# Altium schematic sheet power.SchDoc
size A4; SheetNumber: 4; SheetTotal: 5
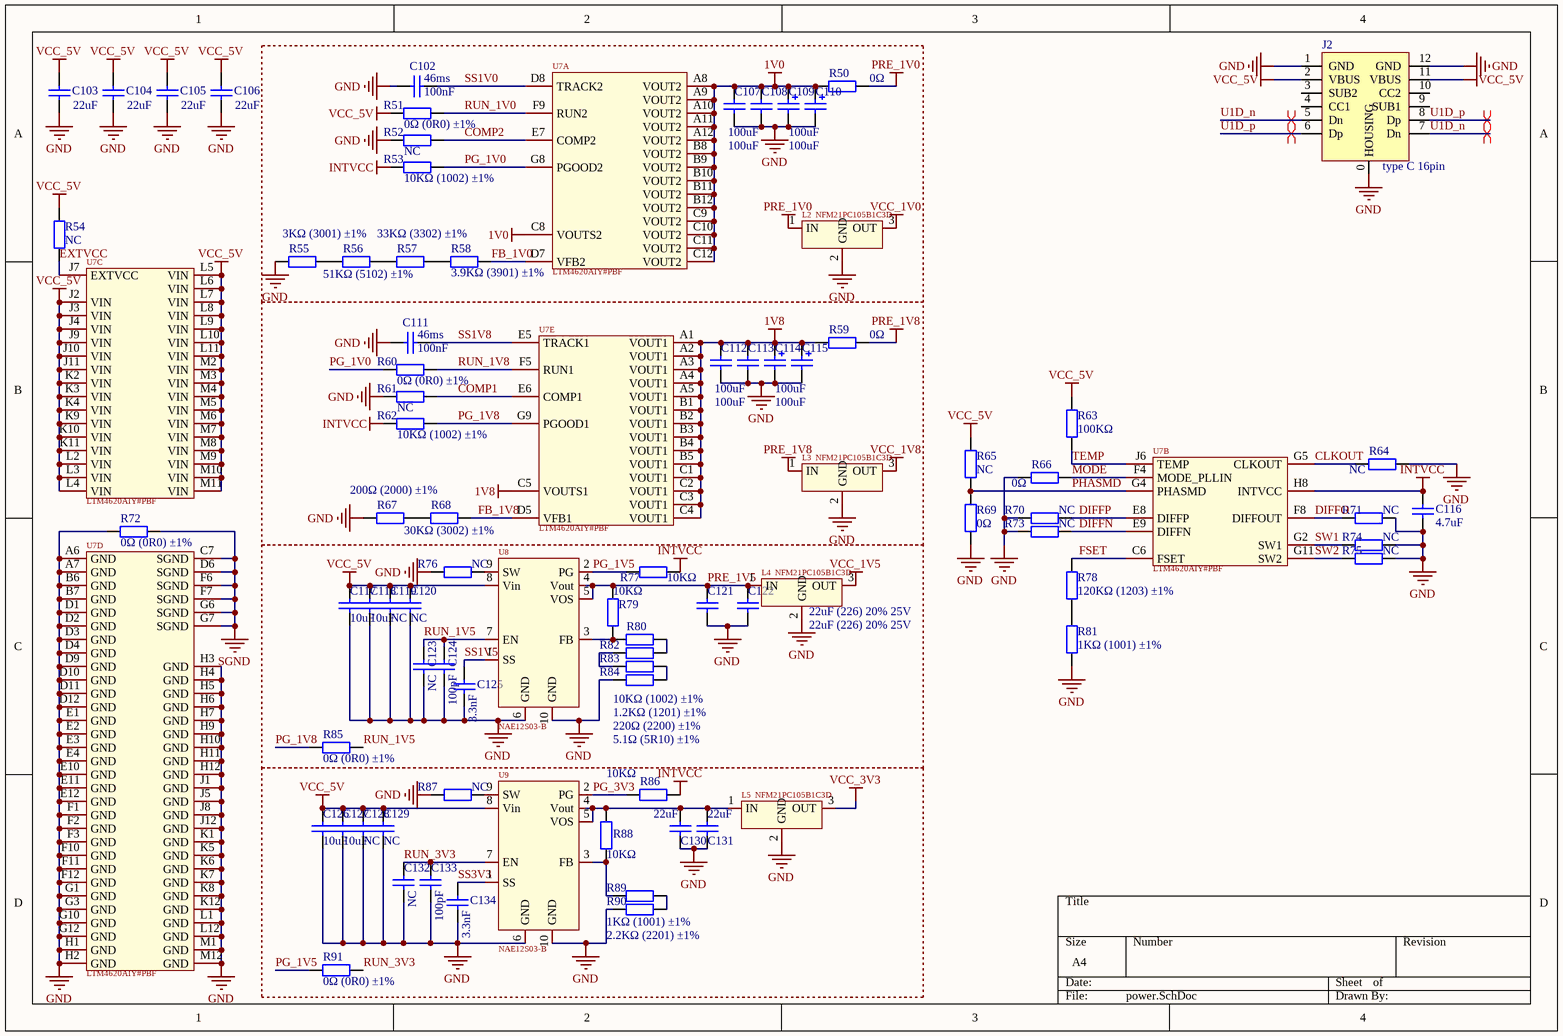
[diagram p0: power.SchDoc]

## Parts
C102  100nF  [0805_C]
C103  22uF  [0805_C]
C104  22uF  [0805_C]
C105  22uF  [0805_C]
C106  22uF  [0805_C]
C107  100uF  [1206_C]
C108  100uF  [1206_C]
C109  100uF  [CASE-B_3528]
C110  100uF  [CASE-B_3528]
C111  100nF  [0805_C]
C112  100uF  [1206_C]
C113  100uF  [1206_C]
C114  100uF  [CASE-B_3528]
C115  100uF  [CASE-B_3528]
C116  4.7uF  [0805_C]
C117  10uF  [0805_C]
C118  10uF  [0805_C]
C119  NC  [0805_C]
C120  NC  [0805_C]
C121  22uF (226) 20% 25V  [0805_C]
C122  22uF (226) 20% 25V  [0805_C]
C123  NC  [0805_C]
C124  100pF  [0805_C]
C125  3.3nF  [0805_C]
C126  10uF  [0805_C]
C127  10uF  [0805_C]
C128  NC  [0805_C]
C129  NC  [0805_C]
C130  22uF  [0805_C]
C131  22uF  [0805_C]
C132  NC  [0805_C]
C133  100pF  [0805_C]
C134  3.3nF  [0805_C]
J2  type C 16pin  [USB type C  16pin]
L2  NFM21PC105B1C3D  [FILTER-SMD_3P-L2.0-W1.2-L]
L3  NFM21PC105B1C3D  [FILTER-SMD_3P-L2.0-W1.2-L]
L4  NFM21PC105B1C3D  [FILTER-SMD_3P-L2.0-W1.2-L]
L5  NFM21PC105B1C3D  [FILTER-SMD_3P-L2.0-W1.2-L]
R50  0Ω  [0805_R]
R51  0Ω (0R0) ±1%  [0805_R]
R52  NC  [0805_R]
R53  10KΩ (1002) ±1%  [0805_R]
R54  NC  [0805_R]
R55  3KΩ (3001) ±1%  [0805_R]
R56  51KΩ (5102) ±1%  [0805_R]
R57  33KΩ (3302) ±1%  [0805_R]
R58  3.9KΩ (3901) ±1%  [0805_R]
R59  0Ω  [0805_R]
R60  0Ω (0R0) ±1%  [0805_R]
R61  NC  [0805_R]
R62  10KΩ (1002) ±1%  [0805_R]
R63  100KΩ  [0805_R]
R64  NC  [0805_R]
R65  NC  [0805_R]
R66  0Ω  [0805_R]
R67  200Ω (2000) ±1%  [0805_R]
R68  30KΩ (3002) ±1%  [0805_R]
R69  0Ω  [0805_R]
R70  NC  [0805_R]
R71  NC  [0805_R]
R72  0Ω (0R0) ±1%  [0402_R]
R73  NC  [0805_R]
R74  NC  [0805_R]
R75  NC  [0805_R]
R76  NC  [0805_R]
R77  10KΩ  [0805_R]
R78  120KΩ (1203) ±1%  [0805_R]
R79  10KΩ  [0805_R]
R80  10KΩ (1002) ±1%  [0805_R]
R81  1KΩ (1001) ±1%  [0805_R]
R82  1.2KΩ (1201) ±1%  [0805_R]
R83  220Ω (2200) ±1%  [0805_R]
R84  5.1Ω (5R10) ±1%  [0805_R]
R85  0Ω (0R0) ±1%  [0805_R]
R86  10KΩ  [0805_R]
R87  NC  [0805_R]
R88  10KΩ  [0805_R]
R89  2.2KΩ (2201) ±1%  [0805_R]
R90  1KΩ (1001) ±1%  [0805_R]
R91  0Ω (0R0) ±1%  [0805_R]
U7  LTM4620AIY#PBF  [BGA-144_L15.0-W15.0-R12-C12-P1.27-BL]  (parts A,B,C,D,E of 5)
U8  NAE12S03-B  [PWRM-SMD_HUAWEI_NAE12S03]
U9  NAE12S03-B  [PWRM-SMD_HUAWEI_NAE12S03]

## Blocks framed on the sheet
46ms: C102 C107-C110 L2 R50-R53 R55-R58 U7
46ms: C111-C115 L3 R59-R62 R67 R68 U7

## Nets
1V0: C107.2 C108.2 C109.1 C110.1 R50.1 U7.A8(VOUT2) U7.A9(VOUT2) U7.A10(VOUT2) U7.A11(VOUT2) U7.A12(VOUT2) U7.B8(VOUT2) U7.B9(VOUT2) U7.B10(VOUT2) U7.B11(VOUT2) U7.B12(VOUT2) U7.C8(VOUTS2) U7.C9(VOUT2) U7.C10(VOUT2) U7.C11(VOUT2) U7.C12(VOUT2)
1V8: C112.2 C113.2 C114.1 C115.1 R59.1 U7.A1(VOUT1) U7.A2(VOUT1) U7.A3(VOUT1) U7.A4(VOUT1) U7.A5(VOUT1) U7.B1(VOUT1) U7.B2(VOUT1) U7.B3(VOUT1) U7.B4(VOUT1) U7.B5(VOUT1) U7.C1(VOUT1) U7.C2(VOUT1) U7.C3(VOUT1) U7.C4(VOUT1) U7.C5(VOUTS1)
GND: C102.2 C103.1 C104.1 C105.1 C106.1 C107.1 C108.1 C109.2 C110.2 C111.2 C112.1 C113.1 C114.2 C115.2 C116.1 C117.1 C118.1 C119.1 C120.1 C121.1 C122.1 C123.1 C124.1 C125.1 C126.1 C127.1 C128.1 C129.1 C130.1 C131.1 C132.1 C133.1 C134.1 J2.0(HOUSING) J2.1(GND) J2.12(GND) L2.2(GND) L3.2(GND) L4.2(GND) L5.2(GND) R52.1 R55.2 R61.1 R64.1 R66.2 R67.1 R69.1 R70.2 R71.1 R72.2 R73.2 R74.1 R75.1 R76.2 R81.1 R84.2 R87.2 R90.2 U7.A6(GND) U7.A7(GND) U7.B6(GND) U7.B7(GND) U7.D1(GND) U7.D2(GND) U7.D3(GND) U7.D4(GND) U7.D9(GND) U7.D10(GND) U7.D11(GND) U7.D12(GND) U7.E1(GND) U7.E2(GND) U7.E3(GND) U7.E4(GND) U7.E10(GND) U7.E11(GND) U7.E12(GND) U7.F1(GND) U7.F2(GND) U7.F3(GND) U7.F10(GND) U7.F11(GND) U7.F12(GND) U7.G1(GND) U7.G3(GND) U7.G10(GND) U7.G12(GND) U7.H1(GND) U7.H2(GND) U7.H3(GND) U7.H4(GND) U7.H5(GND) U7.H6(GND) U7.H7(GND) U7.H9(GND) U7.H10(GND) U7.H11(GND) U7.H12(GND) U7.J1(GND) U7.J5(GND) U7.J8(GND) U7.J12(GND) U7.K1(GND) U7.K5(GND) U7.K6(GND) U7.K7(GND) U7.K8(GND) U7.K12(GND) U7.L1(GND) U7.L12(GND) U7.M1(GND) U7.M12(GND) U8.6(GND) U8.10(GND) U9.6(GND) U9.10(GND)
INTVCC: C116.2 R53.2 R62.2 R77.2 R86.2 U7.H8(INTVCC)
PRE_1V0: L2.1(IN) R50.2
PRE_1V8: L3.1(IN) R59.2
SGND: R72.1 U7.C7(SGND) U7.D6(SGND) U7.F6(SGND) U7.F7(SGND) U7.G6(SGND) U7.G7(SGND)
VCC_1V0: L2.3(OUT)
VCC_1V5: L4.3(OUT)
VCC_1V8: L3.3(OUT)
VCC_3V3: L5.3(OUT)
VCC_5V: C103.2 C104.2 C105.2 C106.2 C117.2 C118.2 C119.2 C120.2 C126.2 C127.2 C128.2 C129.2 J2.2(VBUS) J2.11(VBUS) R51.2 R54.1 R63.2 R65.2 U7.J2(VIN) U7.J3(VIN) U7.J4(VIN) U7.J9(VIN) U7.J10(VIN) U7.J11(VIN) U7.K2(VIN) U7.K3(VIN) U7.K4(VIN) U7.K9(VIN) U7.K10(VIN) U7.K11(VIN) U7.L2(VIN) U7.L3(VIN) U7.L4(VIN) U7.L5(VIN) U7.L6(VIN) U7.L7(VIN) U7.L8(VIN) U7.L9(VIN) U7.L10(VIN) U7.L11(VIN) U7.M2(VIN) U7.M3(VIN) U7.M4(VIN) U7.M5(VIN) U7.M6(VIN) U7.M7(VIN) U7.M8(VIN) U7.M9(VIN) U7.M10(VIN) U7.M11(VIN) U8.8(Vin) U9.8(Vin)
CLKOUT: R64.2 U7.G5(CLKOUT)
COMP1: R61.2 U7.E6(COMP1)
COMP2: R52.2 U7.E7(COMP2)
DIFFN: R73.1 U7.E9(DIFFN)
DIFFO: R71.2 U7.F8(DIFFOUT)
DIFFP: R70.1 U7.E8(DIFFP)
EXTVCC: R54.2 U7.J7(EXTVCC)
FB_1V0: R58.2 U7.D7(VFB2)
FB_1V8: R68.2 U7.D5(VFB1)
FSET: R78.2 U7.C6(FSET)
MODE: R66.1 U7.F4(MODE_PLLIN)
PG_1V0: R53.1 R60.2 U7.G8(PGOOD2)
PG_1V5: R77.1 R91.2 U8.2(PG)
PG_1V8: R62.1 R85.2 U7.G9(PGOOD1)
PG_3V3: R86.1 U9.2(PG)
PHASMD: R65.1 R69.2 U7.G4(PHASMD)
PRE_1V5: C121.2 C122.2 L4.1(IN) R79.2 U8.4(Vout) U8.5(VOS)
RUN_1V0: R51.1 U7.F9(RUN2)
RUN_1V5: C123.2 C124.2 R85.1 U8.7(EN)
RUN_1V8: R60.1 U7.F5(RUN1)
RUN_3V3: C132.2 C133.2 R91.1 U9.7(EN)
SS1V0: C102.1 U7.D8(TRACK2)
SS1V5: C125.2 U8.1(SS)
SS1V8: C111.1 U7.E5(TRACK1)
SS3V3: C134.2 U9.1(SS)
SW1: R74.2 U7.G2(SW1)
SW2: R75.2 U7.G11(SW2)
TEMP: R63.1 U7.J6(TEMP)
U1D_n: J2.5(Dn) J2.7(Dn)
U1D_p: J2.6(Dp) J2.8(Dp)
NetC130_2: C130.2 C131.2 L5.1(IN) R88.2 U9.4(Vout) U9.5(VOS)
NetR55_1: R55.1 R56.1
NetR56_2: R56.2 R57.1
NetR57_2: R57.2 R58.1
NetR67_2: R67.2 R68.1
NetR76_1: R76.1 U8.9(SW)
NetR78_1: R78.1 R81.2
NetR79_1: R79.1 R80.1 U8.3(FB)
NetR80_2: R80.2 R82.1
NetR82_2: R82.2 R83.2
NetR83_1: R83.1 R84.1
NetR87_1: R87.1 U9.9(SW)
NetR88_1: R88.1 R89.1 U9.3(FB)
NetR89_2: R89.2 R90.1

Not connected (* = marked no-connect by the designer): J2 3(SUB2) 4(CC1) 9(SUB1) 10(CC2)

## Layout directives
differential pair: U1D_n, U1D_p

## Library data of the parts
C102 C111 = 0805 100nF(104) 10% 50V: 贴片电容; ComponentLink1Description: 供应商链接; ComponentLink1URL: http://www.szlcsc.com/product/details_50686.html; Package: 0805; Supplier: LC; SuppliersPartNumber: C49678
C103-C106 C121 C122 C130 C131 = 0805 22uF (226) 20% 25V: 贴片电容; ComponentLink1Description: 供应商链接; ComponentLink1URL: http://www.szlcsc.com/product/details_46786.html; Package: 0805; Supplier: LC; SuppliersPartNumber: C45783
C107 C108 C112 C113 = 1206 100nF (104) 10% 50V: 贴片电容; ComponentLink1Description: 供应商链接; ComponentLink1URL: http://www.szlcsc.com/product/details_25237.html; Package: 1206; Supplier: LC; SuppliersPartNumber: C24497
C109 C110 C114 C115 = 3528 100uF (107) 10% 6.3V: 钽电容; ComponentLink1Description: 供应商链接; ComponentLink1URL: http://www.szlcsc.com/product/details_16815.html; Package: 3528; Supplier: LC; SuppliersPartNumber: C16133
C116 = 0805 4.7uF (475) 10% 25V: 贴片电容; ComponentLink1Description: 供应商链接; ComponentLink1URL: http://www.szlcsc.com/product/details_2131.html; Package: 0805; Supplier: LC; SuppliersPartNumber: C1779
C117-C120 C126-C129 = 0805 10uF (106) 10% 25V: 贴片电容; ComponentLink1Description: 供应商链接; ComponentLink1URL: http://www.szlcsc.com/product/details_16532.html; Package: 0805; Supplier: LC; SuppliersPartNumber: C15850
C123 C124 C132 C133 = 0805 100pF (101) 5% 50V: 贴片电容; ComponentLink1Description: 供应商链接; ComponentLink1URL: http://www.szlcsc.com/product/details_2142.html; Package: 0805; Supplier: LC; SuppliersPartNumber: C1790
C125 C134 = 0805 3.3nF (332) 10% 50V: 贴片电容; ComponentLink1Description: 供应商链接; ComponentLink1URL: http://www.szlcsc.com/product/details_54191.html; Package: 0805; Supplier: LC; SuppliersPartNumber: C53175
J2 = USB type C 16pin: 16针脚C口
L2-L5 = NFM21PC105B1C3D: 穿心电容; Manufacturer: muRata(村田); Add into BOM: yes; Nominal Capacitance: 1uF; CapacitanceTolerance: ±20%; DC Rated Voltage: 16V; Rated Current: 4A; DC Resistance: 20mΩ; Symbol: NFM21PC105B1C3D; Device: NFM21PC105B1C3D; LCSC Part Name: 1.0uF(105) ±20%16V; Supplier Part: C92518; Manufacturer Part: NFM21PC105B1C3D; Supplier Footprint: SMD-3P,1.2x2mm; JLCPCB Part Class: Extended Part; Datasheet: https://atta.szlcsc.com/upload/public/pdf/source/20170105/1483610797228.pdf; Supplier: LCSC; Convert to PCB: yes; Operating Temperature: -40℃~+85℃
R50 R51 R59 R60 R64-R66 R69-R76 R85 R87 R91 = 0805 0Ω (0R0) 1%: 贴片电阻; ComponentLink1Description: 供应商链接; ComponentLink1URL: http://www.szlcsc.com/product/details_18165.html; Package: 0805; Supplier: LC; SuppliersPartNumber: C17477
R52 R57 R61 R68 = 0805 33KΩ (3302) 1%: 贴片电阻; ComponentLink1Description: 供应商链接; ComponentLink1URL: http://www.szlcsc.com/product/details_18321.html; Package: 0805; Supplier: LC; SuppliersPartNumber: C17633
R53 R62 R77 R79 R80 R86 R88 = 0805 10KΩ (1002) 1%: 贴片电阻; ComponentLink1Description: 供应商链接; ComponentLink1URL: http://www.szlcsc.com/product/details_18102.html; Package: 0805; Supplier: LC; SuppliersPartNumber: C17414
R54 R55 = 0805 3KΩ (3001) 1%: 贴片电阻; ComponentLink1Description: 供应商链接; ComponentLink1URL: http://www.szlcsc.com/product/details_18349.html; Package: 0805; Supplier: LC; SuppliersPartNumber: C17661
R56 = 0805 51KΩ (5102) 1%: 贴片电阻; ComponentLink1Description: 供应商链接; ComponentLink1URL: http://www.szlcsc.com/product/details_18425.html; Package: 0805; Supplier: LC; SuppliersPartNumber: C17737
R58 = 0805 3.9KΩ (3901) 1%: 贴片电阻; ComponentLink1Description: 供应商链接; ComponentLink1URL: http://www.szlcsc.com/product/details_18302.html; Package: 0805; Supplier: LC; SuppliersPartNumber: C17614
R63 = 0805 100KΩ (1003) 1%: 贴片电阻; ComponentLink1Description: 供应商链接; ComponentLink1URL: http://www.szlcsc.com/product/details_18095.html; Package: 0805; Supplier: LC; SuppliersPartNumber: C17407
R67 = 0805 200Ω (2000) 1%: 贴片电阻; ComponentLink1Description: 供应商链接; ComponentLink1URL: http://www.szlcsc.com/product/details_18228.html; Package: 0805; Supplier: LC; SuppliersPartNumber: C17540
R78 = 0402 120KΩ (1203) 1%: 贴片电阻; ComponentLink1Description: 供应商链接; ComponentLink1URL: http://www.szlcsc.com/product/details_26493.html; Package: 0402; Supplier: LC; SuppliersPartNumber: C25750
R81 = 0402 1KΩ (1001) 1%: 贴片电阻; ComponentLink1Description: 供应商链接; ComponentLink1URL: http://www.szlcsc.com/product/details_12256.html; Package: 0402; Supplier: LC; SuppliersPartNumber: C11702
R82 = 0805 1.2KΩ (1201) 1%: 贴片电阻; ComponentLink1Description: 供应商链接; ComponentLink1URL: http://www.szlcsc.com/product/details_18067.html; Package: 0805; Supplier: LC; SuppliersPartNumber: C17379
R83 = 0805 220Ω (2200) 1%: 贴片电阻; ComponentLink1Description: 供应商链接; ComponentLink1URL: http://www.szlcsc.com/product/details_18245.html; Package: 0805; Supplier: LC; SuppliersPartNumber: C17557
R84 = 0805 5.1Ω (5R10) 1%: 贴片电阻; ComponentLink1Description: 供应商链接; ComponentLink1URL: http://www.szlcsc.com/product/details_18412.html; Package: 0805; Supplier: LC; SuppliersPartNumber: C17724
R89 = 0805 2.2KΩ (2201) 1%: 贴片电阻; ComponentLink1Description: 供应商链接; ComponentLink1URL: http://www.szlcsc.com/product/details_18208.html; Package: 0805; Supplier: LC; SuppliersPartNumber: C17520
R90 = 0805 1KΩ (1001) 1%: 贴片电阻; ComponentLink1Description: 供应商链接; ComponentLink1URL: http://www.szlcsc.com/product/details_18201.html; Package: 0805; Supplier: LC; SuppliersPartNumber: C17513
U7 = LTM4620AIY#PBF: ADI电源; Manufacturer: ADI(亚德诺); Add into BOM: yes; Conversion Type: DC-DC; Input Voltage(DC): 4.5V~16V; Output Voltage: 0.6V~5.3V; Output Current (Max): 13A; Output Channel: 2; Symbol: LTM4620AIY#PBF; Device: LTM4620AIY#PBF; LCSC Part Name: 双通道 13A 或单通道 26A DC/DC uModule 稳压器; Supplier Part: C108015; Manufacturer Part: LTM4620AIY#PBF; Supplier Footprint: BGA-144(15x15); JLCPCB Part Class: Extended Part; Datasheet: https://atta.szlcsc.com/upload/public/pdf/source/20191223/C471410_9980ECA8DA2BC0F921CA49592D580556.pdf; Supplier: LCSC; Convert to PCB: yes; Output Power: -; Insulated Voltage: -; Conversion Efficiency: -; Feature: 过压保护；欠压保护；过流保护; Maximum Capacitive Load: -
U8 U9 = NAE12S03-B: 华为电源模块; Manufacturer: HUAWEI(华为); Add into BOM: yes; Conversion Type: DC-DC; Input Voltage(DC): 6.3V~14V; Output Voltage: 0.8V~5.2V; Output Power: 15W; Output Current (Max): 3A; Output Channel: 1; Maximum Capacitive Load: 500uF; Symbol: NAE12S03-B; Device: NAE12S03-B; LCSC Part Name: NAE12S03-B; Supplier Part: C5632472; Manufacturer Part: NAE12S03-B; Supplier Footprint: -; JLCPCB Part Class: Extended Part; Datasheet: https://atta.szlcsc.com/upload/public/pdf/source/20230428/342BA0ED97D448F86BA8DB326342F56D.pdf; Supplier: LCSC; Convert to PCB: yes